# EAGLE design tron_disc (EAGLE 6.5.0)

## Sheet 1 of 3
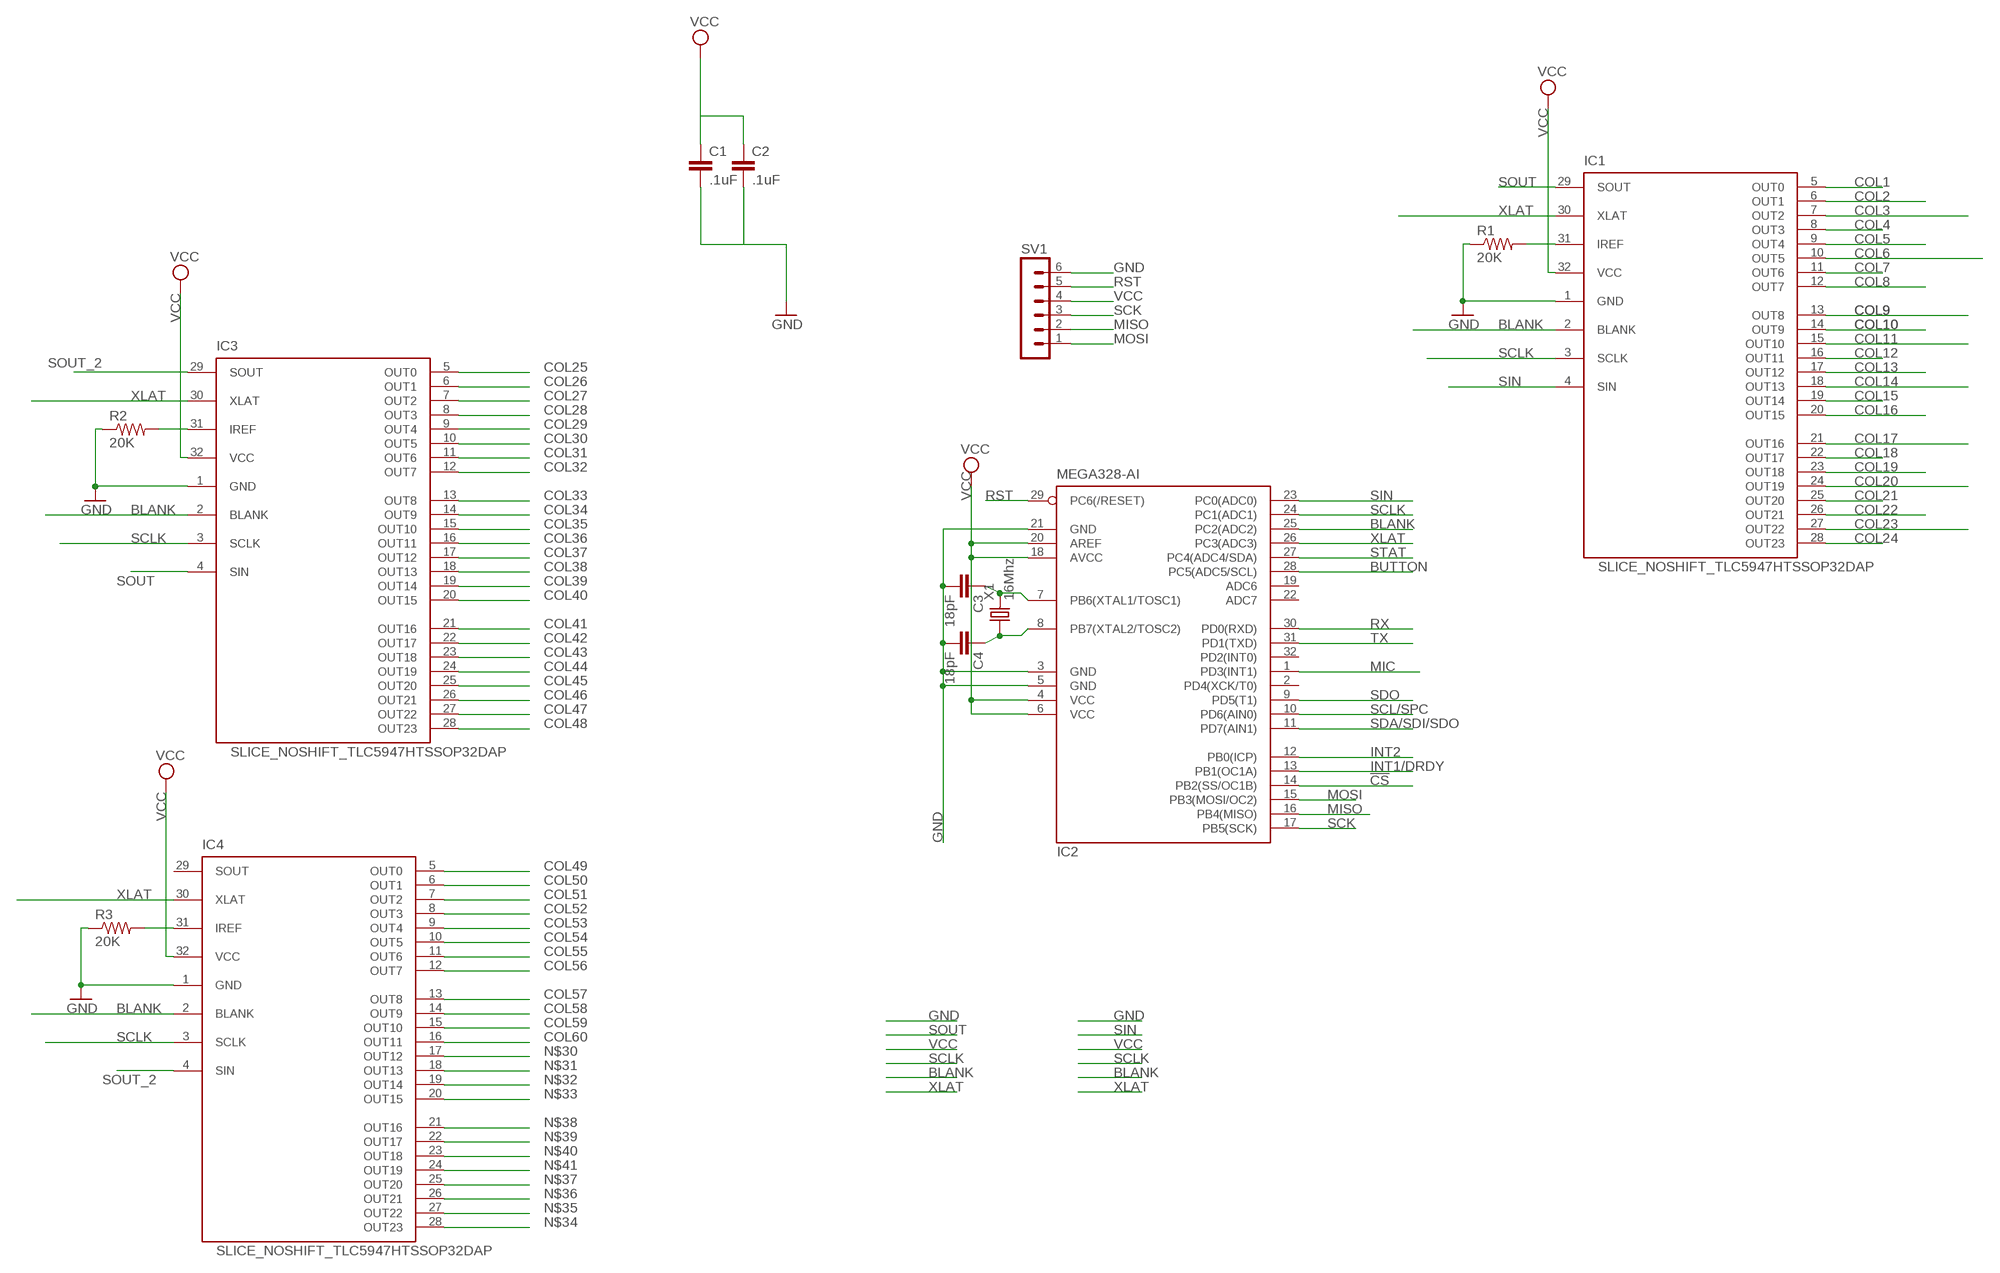
[diagram p0: schematic, sheet 1]

### Parts
C1  .1uF  CAP0805  [0805]
C2  .1uF  CAP0805  [0805]
C3  18pF  CAP0805  [0805]
C4  18pF  CAP0805  [0805]
IC1  SLICE_NOSHIFT_TLC5947HTSSOP32DAP  [HTSSOP32DAP]
IC2  MEGA328-AI  MEGA8-AI  [TQFP32-08]
IC3  SLICE_NOSHIFT_TLC5947HTSSOP32DAP  [HTSSOP32DAP]
IC4  SLICE_NOSHIFT_TLC5947HTSSOP32DAP  [HTSSOP32DAP]
R1  20K  R-US_R0805  [R0805]
R2  20K  R-US_R0805  [R0805]
R3  20K  R-US_R0805  [R0805]
SV1  MA06-1  [MA06-1]
X1  16Mhz  CRYSTAL-5032  [5032]

### Nets
!CS: IC2.14(PB2(SS/OC1B))
BLANK: IC1.2(BLANK) IC2.25(PC2(ADC2)) IC3.2(BLANK) IC4.2(BLANK)
BUTTON: IC2.28(PC5(ADC5/SCL)) ; also sheet 3
COL1: IC1.5(OUT0) ; also sheet 2
COL2: IC1.6(OUT1) ; also sheet 2
COL3: IC1.7(OUT2) ; also sheet 2
COL4: IC1.8(OUT3) ; also sheet 2
COL5: IC1.9(OUT4) ; also sheet 2
COL6: IC1.10(OUT5) ; also sheet 2
COL7: IC1.11(OUT6) ; also sheet 2
COL8: IC1.12(OUT7) ; also sheet 2
COL9: IC1.13(OUT8) ; also sheet 2
COL10: IC1.14(OUT9) ; also sheet 2
COL11: IC1.15(OUT10) ; also sheet 2
COL12: IC1.16(OUT11) ; also sheet 2
COL13: IC1.17(OUT12) ; also sheet 2
COL14: IC1.18(OUT13) ; also sheet 2
COL15: IC1.19(OUT14) ; also sheet 2
COL16: IC1.20(OUT15) ; also sheet 2
COL17: IC1.21(OUT16) ; also sheet 2
COL18: IC1.22(OUT17) ; also sheet 2
COL19: IC1.23(OUT18) ; also sheet 2
COL20: IC1.24(OUT19) ; also sheet 2
COL21: IC1.25(OUT20) ; also sheet 2
COL22: IC1.26(OUT21) ; also sheet 2
COL23: IC1.27(OUT22) ; also sheet 2
COL24: IC1.28(OUT23) ; also sheet 2
COL25: IC3.5(OUT0) ; also sheet 2
COL26: IC3.6(OUT1) ; also sheet 2
COL27: IC3.7(OUT2) ; also sheet 2
COL28: IC3.8(OUT3) ; also sheet 2
COL29: IC3.9(OUT4) ; also sheet 2
COL30: IC3.10(OUT5) ; also sheet 2
COL31: IC3.11(OUT6) ; also sheet 2
COL32: IC3.12(OUT7) ; also sheet 2
COL33: IC3.13(OUT8) ; also sheet 2
COL34: IC3.14(OUT9) ; also sheet 2
COL35: IC3.15(OUT10) ; also sheet 2
COL36: IC3.16(OUT11) ; also sheet 2
COL37: IC3.17(OUT12) ; also sheet 2
COL38: IC3.18(OUT13) ; also sheet 2
COL39: IC3.19(OUT14) ; also sheet 2
COL40: IC3.20(OUT15) ; also sheet 2
COL41: IC3.21(OUT16) ; also sheet 2
COL42: IC3.22(OUT17) ; also sheet 2
COL43: IC3.23(OUT18) ; also sheet 2
COL44: IC3.24(OUT19) ; also sheet 2
COL45: IC3.25(OUT20) ; also sheet 2
COL46: IC3.26(OUT21) ; also sheet 2
COL47: IC3.27(OUT22) ; also sheet 2
COL48: IC3.28(OUT23) ; also sheet 2
COL49: IC4.5(OUT0) ; also sheet 2
COL50: IC4.6(OUT1) ; also sheet 2
COL51: IC4.7(OUT2) ; also sheet 2
COL52: IC4.8(OUT3) ; also sheet 2
COL53: IC4.9(OUT4) ; also sheet 2
COL54: IC4.10(OUT5) ; also sheet 2
COL55: IC4.11(OUT6) ; also sheet 2
COL56: IC4.12(OUT7) ; also sheet 2
COL57: IC4.13(OUT8) ; also sheet 2
COL58: IC4.14(OUT9) ; also sheet 2
COL59: IC4.15(OUT10) ; also sheet 2
COL60: IC4.16(OUT11) ; also sheet 2
GND: C1.2 C2.2 C3.2 C4.2 IC1.1(GND) IC2.3(GND) IC2.5(GND) IC2.21(GND) IC3.1(GND) IC4.1(GND) R1.1 R2.1 R3.1 SV1.6 ; also sheet 3
INT1/DRDY: IC2.13(PB1(OC1A))
INT2: IC2.12(PB0(ICP))
MIC: IC2.1(PD3(INT1))
MISO: IC2.16(PB4(MISO)) SV1.2
MOSI: IC2.15(PB3(MOSI/OC2)) SV1.1
N$1: IC3.31(IREF) R2.2
N$7: C3.1 IC2.7(PB6(XTAL1/TOSC1)) X1.2
N$8: C4.1 IC2.8(PB7(XTAL2/TOSC2)) X1.1
N$13: IC1.31(IREF) R1.2
N$30: IC4.17(OUT12)
N$31: IC4.18(OUT13)
N$32: IC4.19(OUT14)
N$33: IC4.20(OUT15)
N$34: IC4.28(OUT23)
N$35: IC4.27(OUT22)
N$36: IC4.26(OUT21)
N$37: IC4.25(OUT20)
N$38: IC4.21(OUT16)
N$39: IC4.22(OUT17)
N$40: IC4.23(OUT18)
N$41: IC4.24(OUT19)
N$64: IC4.31(IREF) R3.2
RST: IC2.29(PC6(/RESET)) SV1.5 ; also sheet 3
RX: IC2.30(PD0(RXD))
SCK: IC2.17(PB5(SCK)) SV1.3
SCL/SPC: IC2.10(PD6(AIN0))
SCLK: IC1.3(SCLK) IC2.24(PC1(ADC1)) IC3.3(SCLK) IC4.3(SCLK)
SDA/SDI/SDO: IC2.11(PD7(AIN1))
SDO: IC2.9(PD5(T1))
SIN: IC1.4(SIN) IC2.23(PC0(ADC0))
SOUT: IC1.29(SOUT) IC3.4(SIN)
SOUT_2: IC3.29(SOUT) IC4.4(SIN)
STAT: IC2.27(PC4(ADC4/SDA))
TX: IC2.31(PD1(TXD))
VCC: C1.1 C2.1 IC1.32(VCC) IC2.4(VCC) IC2.6(VCC) IC2.18(AVCC) IC2.20(AREF) IC3.32(VCC) IC4.32(VCC) SV1.4 ; also sheet 2
XLAT: IC1.30(XLAT) IC2.26(PC3(ADC3)) IC3.30(XLAT) IC4.30(XLAT)
Unconnected: IC2.2(PD4(XCK/T0)) IC2.19(ADC6) IC2.22(ADC7) IC2.32(PD2(INT0)) IC4.29(SOUT)

## Sheet 2 of 3
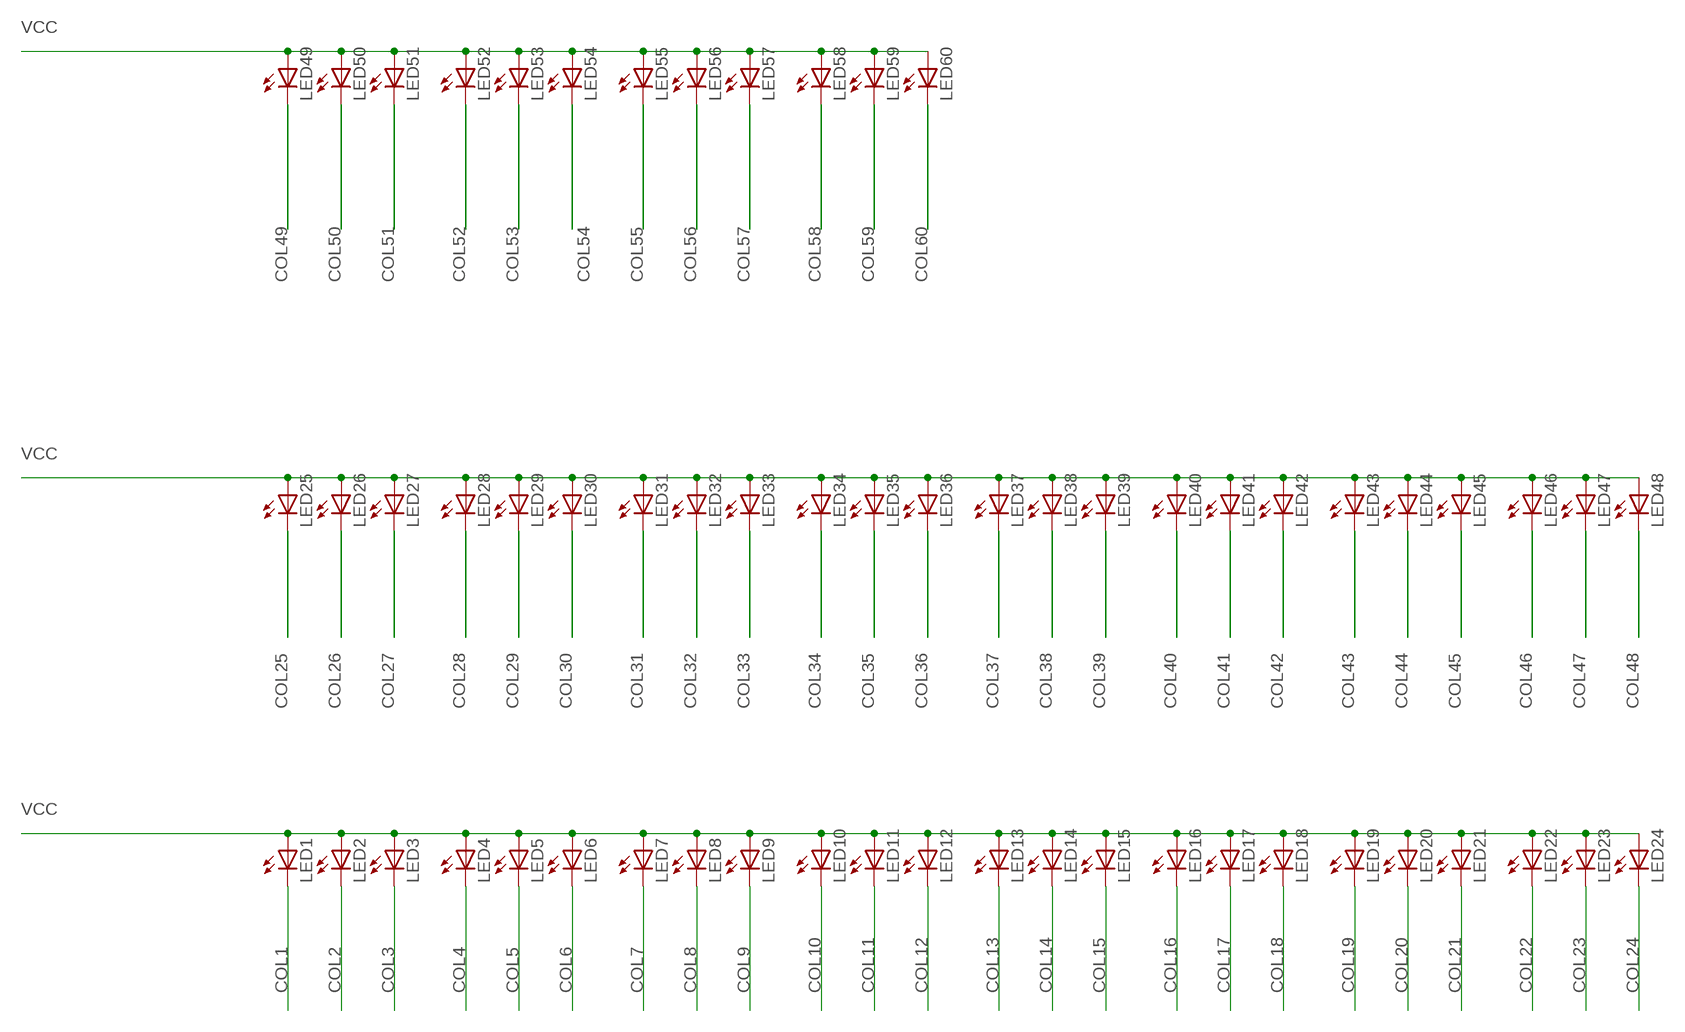
[diagram p1: schematic, sheet 2]

### Parts
LED1  LEDCHIPLED_1206  [CHIPLED_1206]
LED2  LEDCHIPLED_1206  [CHIPLED_1206]
LED3  LEDCHIPLED_1206  [CHIPLED_1206]
LED4  LEDCHIPLED_1206  [CHIPLED_1206]
LED5  LEDCHIPLED_1206  [CHIPLED_1206]
LED6  LEDCHIPLED_1206  [CHIPLED_1206]
LED7  LEDCHIPLED_1206  [CHIPLED_1206]
LED8  LEDCHIPLED_1206  [CHIPLED_1206]
LED9  LEDCHIPLED_1206  [CHIPLED_1206]
LED10  LEDCHIPLED_1206  [CHIPLED_1206]
LED11  LEDCHIPLED_1206  [CHIPLED_1206]
LED12  LEDCHIPLED_1206  [CHIPLED_1206]
LED13  LEDCHIPLED_1206  [CHIPLED_1206]
LED14  LEDCHIPLED_1206  [CHIPLED_1206]
LED15  LEDCHIPLED_1206  [CHIPLED_1206]
LED16  LEDCHIPLED_1206  [CHIPLED_1206]
LED17  LEDCHIPLED_1206  [CHIPLED_1206]
LED18  LEDCHIPLED_1206  [CHIPLED_1206]
LED19  LEDCHIPLED_1206  [CHIPLED_1206]
LED20  LEDCHIPLED_1206  [CHIPLED_1206]
LED21  LEDCHIPLED_1206  [CHIPLED_1206]
LED22  LEDCHIPLED_1206  [CHIPLED_1206]
LED23  LEDCHIPLED_1206  [CHIPLED_1206]
LED24  LEDCHIPLED_1206  [CHIPLED_1206]
LED25  LEDCHIPLED_1206  [CHIPLED_1206]
LED26  LEDCHIPLED_1206  [CHIPLED_1206]
LED27  LEDCHIPLED_1206  [CHIPLED_1206]
LED28  LEDCHIPLED_1206  [CHIPLED_1206]
LED29  LEDCHIPLED_1206  [CHIPLED_1206]
LED30  LEDCHIPLED_1206  [CHIPLED_1206]
LED31  LEDCHIPLED_1206  [CHIPLED_1206]
LED32  LEDCHIPLED_1206  [CHIPLED_1206]
LED33  LEDCHIPLED_1206  [CHIPLED_1206]
LED34  LEDCHIPLED_1206  [CHIPLED_1206]
LED35  LEDCHIPLED_1206  [CHIPLED_1206]
LED36  LEDCHIPLED_1206  [CHIPLED_1206]
LED37  LEDCHIPLED_1206  [CHIPLED_1206]
LED38  LEDCHIPLED_1206  [CHIPLED_1206]
LED39  LEDCHIPLED_1206  [CHIPLED_1206]
LED40  LEDCHIPLED_1206  [CHIPLED_1206]
LED41  LEDCHIPLED_1206  [CHIPLED_1206]
LED42  LEDCHIPLED_1206  [CHIPLED_1206]
LED43  LEDCHIPLED_1206  [CHIPLED_1206]
LED44  LEDCHIPLED_1206  [CHIPLED_1206]
LED45  LEDCHIPLED_1206  [CHIPLED_1206]
LED46  LEDCHIPLED_1206  [CHIPLED_1206]
LED47  LEDCHIPLED_1206  [CHIPLED_1206]
LED48  LEDCHIPLED_1206  [CHIPLED_1206]
LED49  LEDCHIPLED_1206  [CHIPLED_1206]
LED50  LEDCHIPLED_1206  [CHIPLED_1206]
LED51  LEDCHIPLED_1206  [CHIPLED_1206]
LED52  LEDCHIPLED_1206  [CHIPLED_1206]
LED53  LEDCHIPLED_1206  [CHIPLED_1206]
LED54  LEDCHIPLED_1206  [CHIPLED_1206]
LED55  LEDCHIPLED_1206  [CHIPLED_1206]
LED56  LEDCHIPLED_1206  [CHIPLED_1206]
LED57  LEDCHIPLED_1206  [CHIPLED_1206]
LED58  LEDCHIPLED_1206  [CHIPLED_1206]
LED59  LEDCHIPLED_1206  [CHIPLED_1206]
LED60  LEDCHIPLED_1206  [CHIPLED_1206]

### Nets
COL1: LED1.C ; also sheet 1
COL2: LED2.C ; also sheet 1
COL3: LED3.C ; also sheet 1
COL4: LED4.C ; also sheet 1
COL5: LED5.C ; also sheet 1
COL6: LED6.C ; also sheet 1
COL7: LED7.C ; also sheet 1
COL8: LED8.C ; also sheet 1
COL9: LED9.C ; also sheet 1
COL10: LED10.C ; also sheet 1
COL11: LED11.C ; also sheet 1
COL12: LED12.C ; also sheet 1
COL13: LED13.C ; also sheet 1
COL14: LED14.C ; also sheet 1
COL15: LED15.C ; also sheet 1
COL16: LED16.C ; also sheet 1
COL17: LED17.C ; also sheet 1
COL18: LED18.C ; also sheet 1
COL19: LED19.C ; also sheet 1
COL20: LED20.C ; also sheet 1
COL21: LED21.C ; also sheet 1
COL22: LED22.C ; also sheet 1
COL23: LED23.C ; also sheet 1
COL24: LED24.C ; also sheet 1
COL25: LED25.C ; also sheet 1
COL26: LED26.C ; also sheet 1
COL27: LED27.C ; also sheet 1
COL28: LED28.C ; also sheet 1
COL29: LED29.C ; also sheet 1
COL30: LED30.C ; also sheet 1
COL31: LED31.C ; also sheet 1
COL32: LED32.C ; also sheet 1
COL33: LED33.C ; also sheet 1
COL34: LED34.C ; also sheet 1
COL35: LED35.C ; also sheet 1
COL36: LED36.C ; also sheet 1
COL37: LED37.C ; also sheet 1
COL38: LED38.C ; also sheet 1
COL39: LED39.C ; also sheet 1
COL40: LED40.C ; also sheet 1
COL41: LED41.C ; also sheet 1
COL42: LED42.C ; also sheet 1
COL43: LED43.C ; also sheet 1
COL44: LED44.C ; also sheet 1
COL45: LED45.C ; also sheet 1
COL46: LED46.C ; also sheet 1
COL47: LED47.C ; also sheet 1
COL48: LED48.C ; also sheet 1
COL49: LED49.C ; also sheet 1
COL50: LED50.C ; also sheet 1
COL51: LED51.C ; also sheet 1
COL52: LED52.C ; also sheet 1
COL53: LED53.C ; also sheet 1
COL54: LED54.C ; also sheet 1
COL55: LED55.C ; also sheet 1
COL56: LED56.C ; also sheet 1
COL57: LED57.C ; also sheet 1
COL58: LED58.C ; also sheet 1
COL59: LED59.C ; also sheet 1
COL60: LED60.C ; also sheet 1
VCC: LED1.A LED2.A LED3.A LED4.A LED5.A LED6.A LED7.A LED8.A LED9.A LED10.A LED11.A LED12.A LED13.A LED14.A LED15.A LED16.A LED17.A LED18.A LED19.A LED20.A LED21.A LED22.A LED23.A LED24.A LED25.A LED26.A LED27.A LED28.A LED29.A LED30.A LED31.A LED32.A LED33.A LED34.A LED35.A LED36.A LED37.A LED38.A LED39.A LED40.A LED41.A LED42.A LED43.A LED44.A LED45.A LED46.A LED47.A LED48.A LED49.A LED50.A LED51.A LED52.A LED53.A LED54.A LED55.A LED56.A LED57.A LED58.A LED59.A LED60.A ; also sheet 1

## Sheet 3 of 3
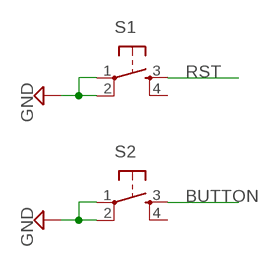
[diagram p2: schematic, sheet 3]

### Parts
S1  TAC_SWITCHSMD  [TACTILE_SWITCH_SMD]
S2  TAC_SWITCHSMD  [TACTILE_SWITCH_SMD]

### Nets
BUTTON: S2.3 ; also sheet 1
GND: S1.1 S1.2 S2.1 S2.2 ; also sheet 1
RST: S1.3 ; also sheet 1
Unconnected: S1.4 S2.4

## Library data of the parts
C1-C4 = slice_noshift:CAP: Capacitor Standard 0603 ceramic capacitor, and 0.1" leaded capacitor.
IC1 IC3 IC4 = 23b_clock_noleds:SLICE_NOSHIFT_TLC5947
IC2 = atmel:MEGA8: MICROCONTROLLER 8 Kbytes FLASH, 1 kbytes SRAM, 512 bytes EEPROM, USART, 6-channel 10 bit ADC, 2-channel 8 bit ADC Pin compatible with Atmega48, ATMega88, ATMega168 Source: avr.lbr; MPN: ATMEGA8-16AU; OC_FARNELL: 9171371; OC_NEWARK: 73M8863
LED1-LED60 = led:LED: LED OSRAM: - CHIPLED LG R971, LG N971, LY N971, LG Q971, LY Q971, LO R971, LY R971 LH N974, LH R974 LS Q976, LO Q976, LY Q976 LO Q996 - Hyper CHIPLED LW Q18S LB Q993, LB Q99A, LB R99A - SideLED LS A670, LO A670, LY A670, LG A670, LP A670 LB A673, LV A673, LT A673, LW A673 LH A674 LY A675 LS A676, LA A676, LO A676, LY A676, LW A676 LS A679, LY A679, LG A679 - Hyper Micro SIDELED® LS Y876, LA Y876, LO Y876, LY Y876 LT Y87S - SmartLED LW L88C, LW L88S LB L89C, LB L89S, LG L890 LS L89K, LO L89K, LY L89K LS L896, LA L896, LO L896, LY L896 - TOPLED LS T670, LO T670, LY T670, LG T670, LP T670 LSG T670, LSP T670, LSY T670, LOP T670, LYG T670 LG T671, LOG T671, LSG T671 LB T673, LV T673, LT T673, LW T673 LH T674 LS T676, LA T676, LO T676, LY T676, LB T676, LH T676, LSB T676, LW T676 LB T67C, LV T67C, LT T67C, LS T67K, LO T67K, LY T67K, LW E67C LS E67B, LA E67B, LO E67B, LY E67B, LB E67C, LV E67C, LT E67C LW T67C LS T679, LY T679, LG T679 LS T770, LO T770, LY T770, LG T770, LP T770 LB T773, LV T773, LT T773, LW T773 LH T774 LS E675, LA E675, LY E675, LS T675 LS T776, LA T776, LO T776, LY T776, LB T776 LHGB T686 LT T68C, LB T68C - Hyper Mini TOPLED® LB M676 - Mini TOPLED Santana® LG M470 LS M47K, LO M47K, LY M47K Source: http://www.osram.convergy.de LUXEON: - LUMILED® LXK2-PW12-R00, LXK2-PW12-S00, LXK2-PW14-U00, LXK2-PW14-V00 LXK2-PM12-R00, LXK2-PM12-S00, LXK2-PM14-U00 LXK2-PE12-Q00, LXK2-PE12-R00, LXK2-PE12-S00, LXK2-PE14-T00, LXK2-PE14-U00 LXK2-PB12-K00, LXK2-PB12-L00, LXK2-PB12-M00, LXK2-PB14-N00, LXK2-PB14-P00, LXK2-PB14-Q00 LXK2-PR12-L00, LXK2-PR12-M00, LXK2-PR14-Q00, LXK2-PR14-R00 LXK2-PD12-Q00, LXK2-PD12-R00, LXK2-PD12-S00 LXK2-PH12-R00, LXK2-PH12-S00 LXK2-PL12-P00, LXK2-PL12-Q00, LXK2-PL12-R00 Source: www.luxeon.com KINGBRIGHT: KA-3528ASYC Source: www.kingbright.com
R1-R3 = rcl:R-US_: RESISTOR, American symbol
S1 S2 = SparkFun:TAC_SWITCH: Momentary Switch Button commonly used for reset or general input. Spark Fun Electronics SKU : COM-00097
SV1 = NSL:MA06-1: PIN HEADER
X1 = NSL_MiniQuad:CRYSTAL*: CRYSTAL

## Net classes
0 default: width 0.254 mm

## Board
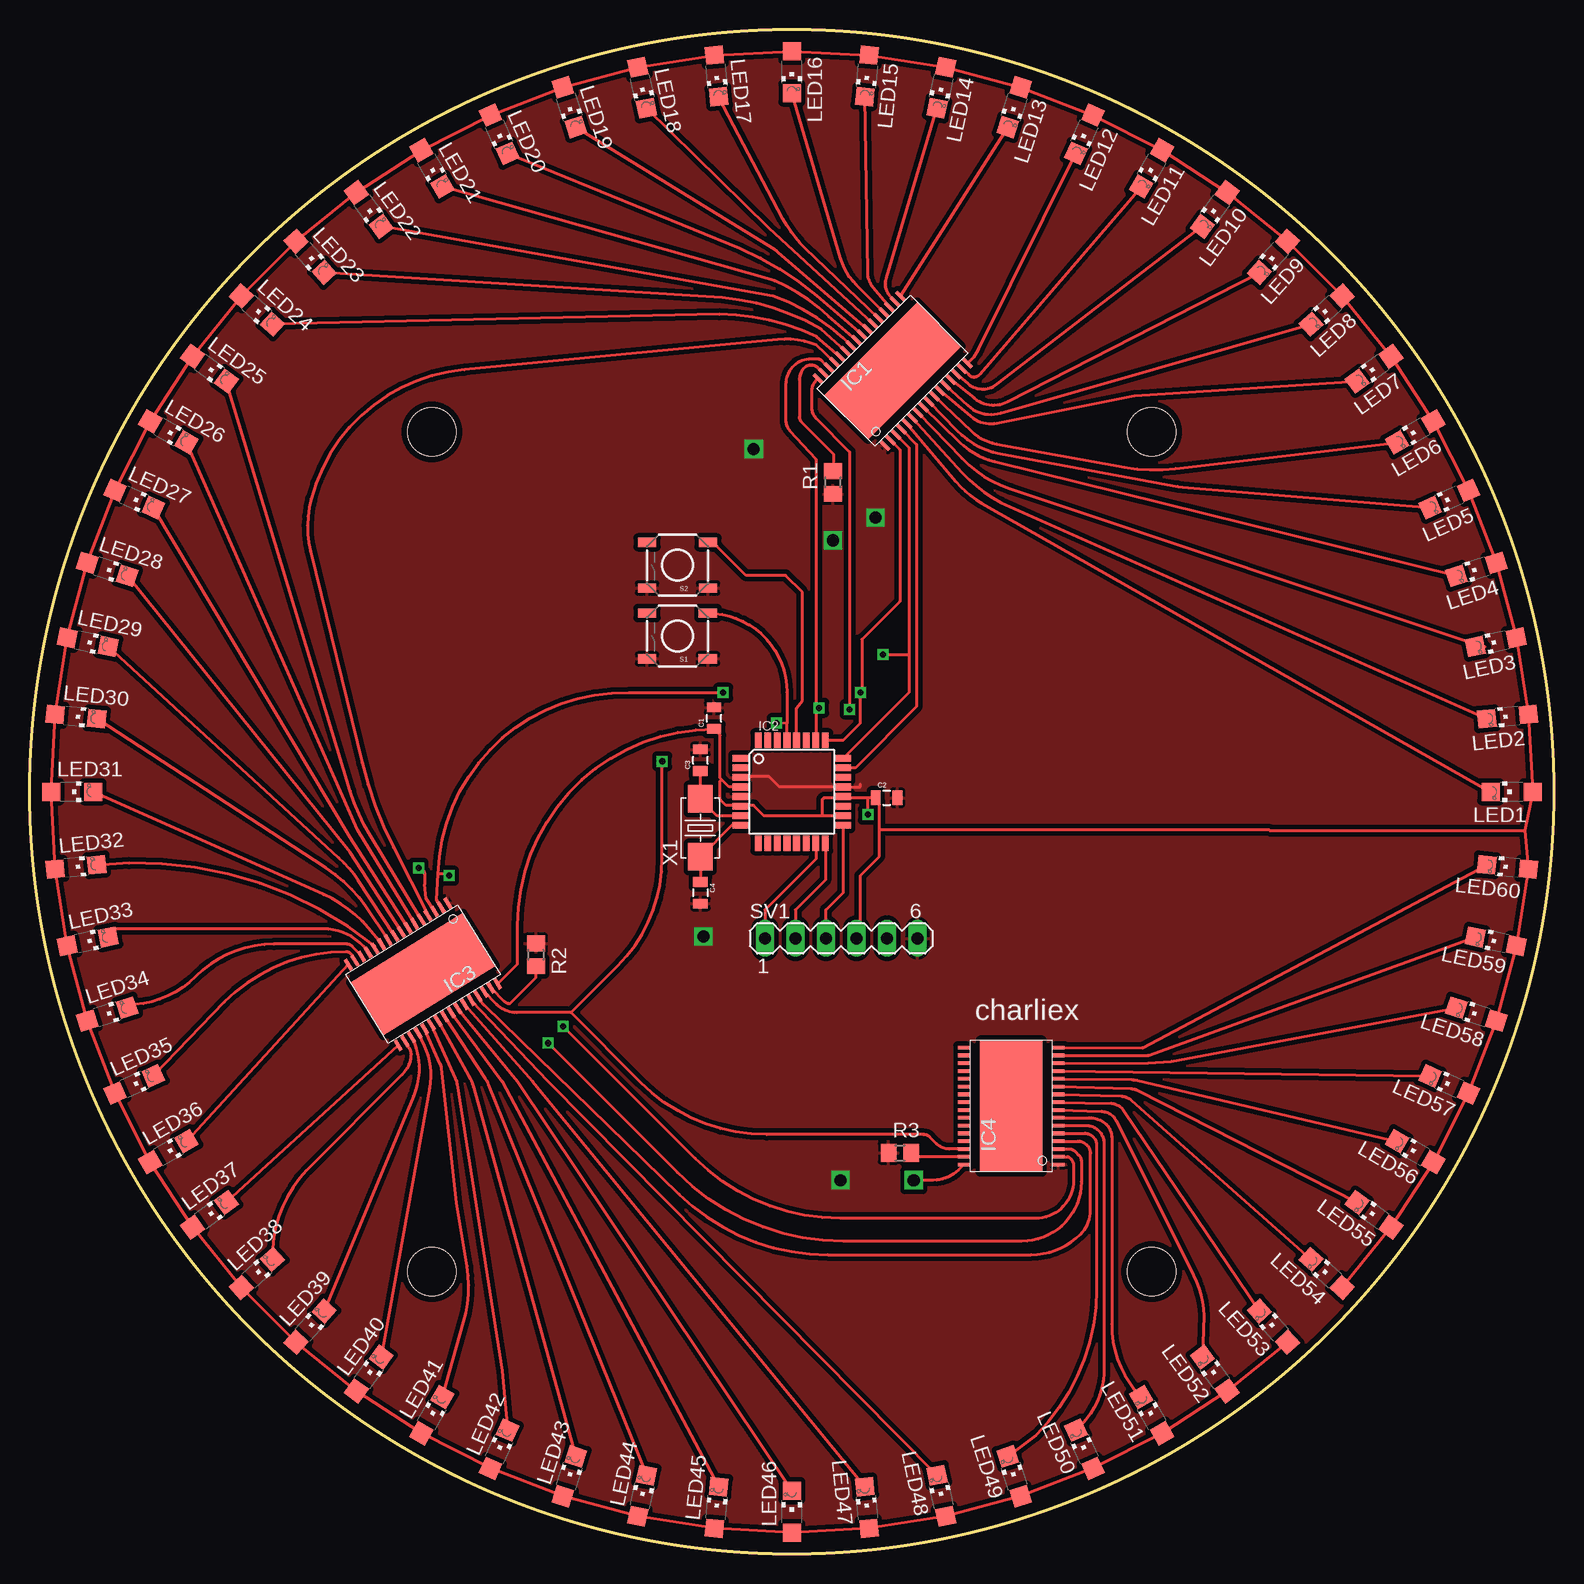
[diagram p3: board, top side]
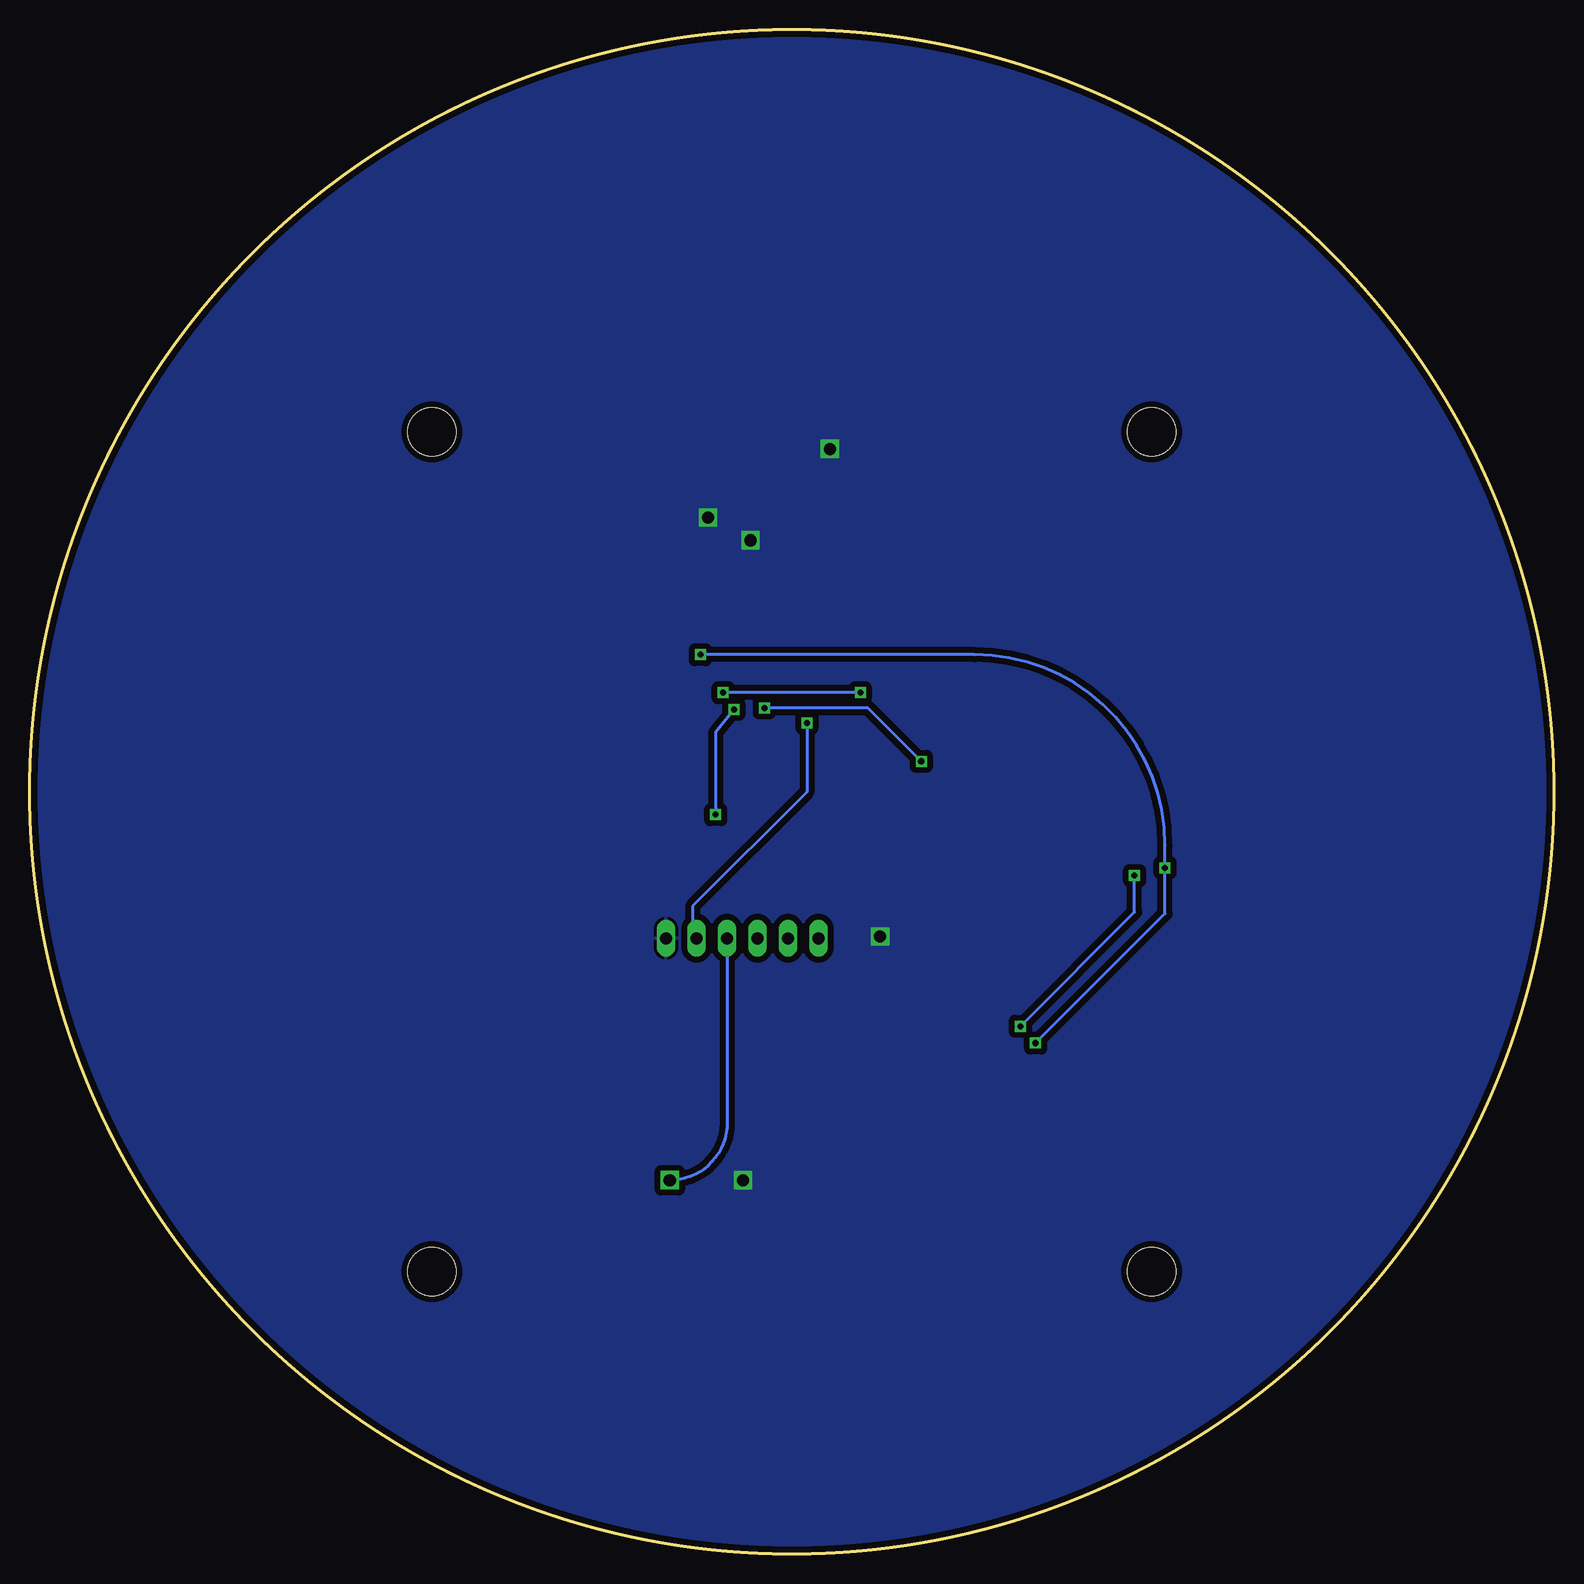
[diagram p4: board, bottom side, seen from below]

Size 127 x 127 mm. Coordinates in mm from the lower left corner, seen from the top.
Outline: circle at 63.5,63.5 radius 63.5
Copper layers (1*16): Top 0.0178mm / dielectric 59mil / Bottom 0.0178mm
Design rules "SSC-EAGLE-2Lyr_v1.0.0.3": minimum track width 6mil, minimum drill 14mil, track to track 6mil, track to pad 6mil, pad to pad 6mil, via to via 6mil, smd to smd 6mil, copper to edge 20mil, drill to drill 16mil, minimum pad ring 8mil, minimum via ring 8mil, stop-mask expansion 3mil, vias tented up to drill 0mil, thermal gap 10mil
Holes 4 mm at 33.5,93.5 33.5,23.5 93.5,23.5 93.5,93.5
Milling: area 0,0 to 127,127

### Footprints (pad centres in the part's own frame; a part is rotated, then mirrored left to right if it is on the bottom)
0805 = smd 0.8 x 1.2: 1 -0.9,0; 2 0.9,0
HTSSOP32DAP = smd 0.3 x 1: 1 -4.875,-3.95; 2 -4.225,-3.95; 3 -3.575,-3.95; 4 -2.925,-3.95; 5 -2.275,-3.95; 6 -1.625,-3.95; 7 -0.975,-3.95; 8 -0.325,-3.95; 9 0.325,-3.95; 10 0.975,-3.95; 11 1.625,-3.95; 12 2.275,-3.95; 13 2.925,-3.95; 14 3.575,-3.95; 15 4.225,-3.95; 16 4.875,-3.95; 17 4.875,3.95; 18 4.225,3.95; 19 3.575,3.95; 20 2.925,3.95; 21 2.275,3.95; 22 1.625,3.95; 23 0.975,3.95; 24 0.325,3.95; 25 -0.325,3.95; 26 -0.975,3.95; 27 -1.625,3.95; 28 -2.275,3.95; 29 -2.925,3.95; 30 -3.575,3.95; 31 -4.225,3.95; 32 -4.875,3.95 | smd 11 x 5.2: EXP 0,0
TQFP32-08 = smd 1.27 x 0.559: 1 -4.293,2.8; 2 -4.293,2; 3 -4.293,1.2; 4 -4.293,0.4; 5 -4.293,-0.4; 6 -4.293,-1.2; 7 -4.293,-2; 8 -4.293,-2.8; 17 4.293,-2.8; 18 4.293,-2; 19 4.293,-1.2; 20 4.293,-0.4; 21 4.293,0.4; 22 4.293,1.2; 23 4.293,2; 24 4.293,2.8 | smd 0.559 x 1.27: 9 -2.8,-4.293; 10 -2,-4.293; 11 -1.2,-4.293; 12 -0.4,-4.293; 13 0.4,-4.293; 14 1.2,-4.293; 15 2,-4.293; 16 2.8,-4.293; 25 2.8,4.293; 26 2,4.293; 27 1.2,4.293; 28 0.4,4.293; 29 -0.4,4.293; 30 -1.2,4.293; 31 -2,4.293; 32 -2.8,4.293
CHIPLED_1206 = smd 1.5 x 1.5: A 0,-1.75; C 0,1.75
R0805 = smd 1.3 x 1.5: 1 -0.95,0; 2 0.95,0
TACTILE_SWITCH_SMD = smd 1.524 x 0.762: 1 -2.54,1.905; 2 2.54,1.905; 3 -2.54,-1.905; 4 2.54,-1.905
MA06-1 = drill 1.016 long: 1 -6.35,0; 2 -3.81,0; 3 -1.27,0; 4 1.27,0; 5 3.81,0; 6 6.35,0
5032 = smd 2.286 x 2.032: 1 -2.413,0; 2 2.413,0

### Placement (x,y rotation side)
C1  57.02,69.63 90 top
C2  71.41,63 0 top
C3  55.88,66.13 90 top
C4  55.88,55.08 270 top
IC1  71.91,98.59 45 top
IC2  63.5,63.5 0 top
IC3  32.76,48.29 211.7 top
IC4  81.79,37.3 90 top
LED1  123.5,63.5 90 top
LED2  123.17,69.77 96 top
LED3  122.19,75.97 102 top
LED4  120.56,82.04 108 top
LED5  118.31,87.9 114 top
LED6  115.46,93.5 120 top
LED7  112.04,98.77 126 top
LED8  108.09,103.65 132 top
LED9  103.65,108.09 138 top
LED10  98.77,112.04 144 top
LED11  93.5,115.46 150 top
LED12  87.9,118.31 156 top
LED13  82.04,120.56 162 top
LED14  75.97,122.19 168 top
LED15  69.77,123.17 174 top
LED16  63.5,123.5 180 top
LED17  57.23,123.17 186 top
LED18  51.03,122.19 192 top
LED19  44.96,120.56 198 top
LED20  39.1,118.31 204 top
LED21  33.5,115.46 210 top
LED22  28.23,112.04 216 top
LED23  23.35,108.09 222 top
LED24  18.91,103.65 228 top
LED25  14.96,98.77 234 top
LED26  11.54,93.5 240 top
LED27  8.69,87.9 246 top
LED28  6.44,82.04 252 top
LED29  4.81,75.97 258 top
LED30  3.83,69.77 264 top
LED31  3.5,63.5 270 top
LED32  3.83,57.23 276 top
LED33  4.81,51.03 282 top
LED34  6.44,44.96 288 top
LED35  8.69,39.1 294 top
LED36  11.54,33.5 300 top
LED37  14.96,28.23 306 top
LED38  18.91,23.35 312 top
LED39  23.35,18.91 318 top
LED40  28.23,14.96 324 top
LED41  33.5,11.54 330 top
LED42  39.1,8.69 336 top
LED43  44.96,6.44 342 top
LED44  51.03,4.81 348 top
LED45  57.23,3.83 354 top
LED46  63.5,3.5 0 top
LED47  69.77,3.83 6 top
LED48  75.97,4.81 12 top
LED49  82.04,6.44 18 top
LED50  87.9,8.69 24 top
LED51  93.5,11.54 30 top
LED52  98.77,14.96 36 top
LED53  103.65,18.91 42 top
LED54  108.09,23.35 48 top
LED55  112.04,28.23 54 top
LED56  115.46,33.5 60 top
LED57  118.31,39.1 66 top
LED58  120.56,44.96 72 top
LED59  122.19,51.03 78 top
LED60  123.17,57.23 84 top
R1  66.93,89.28 90 top
R2  42.17,49.91 270 top
R3  72.52,33.4 0 top
S1  53.97,76.49 180 top
S2  53.98,82.39 180 top
SV1  67.62,51.28 0 top
X1  55.88,60.49 90 top

### Tracks (layer width: path | path; a pad name or v marks a point on that pad's centre or on a via)
BLANK  (via drill 0.51)
  Top 0.254: 34.04,56.64 arc-90 49.91,71.75 v57.78,71.75 | IC4.2 86.47,33.08 arc-45 86.62,33.02 86.8,32.84 arc-45 87,32.36 87,31.12 arc-90 83.82,27.94 67.53,27.94 arc-45 55.45,32.94 v44.45,43.94 | v34.92,56.52 34.8,56.64 34.04,56.64 | IC3.2 33.91,54.49 34.04,56.64 | IC1.2 72.52,92.01 72.52,79.38 69.34,76.2 69.34,72.14 v69.22,71.75 69.22,69.22 67.79,67.79 IC2.25
  Bottom 0.254: v57.78,71.75 v69.22,71.75 | v44.45,43.94 34.92,53.47 v34.92,56.52
BUTTON
  Top 0.254: IC2.28 63.9,70.48 64.39,71.12 64.39,80.14 62.99,81.53 59.69,81.53 57.24,83.98 S2.3
COL1
  Top 0.254: IC1.5 77.2,89.34 arc20 79.33,87.58 LED1.C
COL2
  Top 0.254: IC1.6 77.68,90.12 arc24 81.68,87.26 LED2.C
COL3
  Top 0.254: IC1.7 77.68,91.3 arc28 81.69,88.76 121.28,75.56 LED3.C
COL4
  Top 0.254: IC1.8 77.5,92.64 arc31 80.42,91.03 LED4.C
COL5
  Top 0.254: IC1.9 77.24,93.64 arc36 80.87,91.68 95.24,89.02 arc6 96.54,88.85 LED5.C
COL6
  Top 0.254: IC1.10 78.5,93.55 arc33 80.57,92.49 91.22,90.56 arc18 95.49,90.44 LED6.C
COL7
  Top 0.254: IC1.11 78.41,94.79 arc51 80.61,94.23 92.08,96.52 LED7.C
COL8
  Top 0.254: IC1.12 78.19,95.69 arc59 80.91,95.07 LED8.C
COL9
  Top 0.254: IC1.13 78.71,96.3 arc67 81.49,96.02 LED9.C
COL10
  Top 0.254: IC1.14 78.2,97.52 arc78 80.59,97.47 LED10.C
COL11
  Top 0.254: IC1.15 78.25,98.25 arc93 79.17,98.3 LED11.C
COL12
  Top 0.254: IC1.16 arc26 79.07,100.36 LED12.C
COL13
  Top 0.254: IC1.17 LED13.C
COL14
  Top 0.254: IC1.18 71.75,104.74 arc-60 71.38,106.29 LED14.C
COL15
  Top 0.254: IC1.19 70.29,105.53 arc-39 69.84,106.72 LED15.C
COL16
  Top 0.254: IC1.20 68.89,105.74 arc-29 67.58,107.96 LED16.C
COL17
  Top 0.254: IC1.21 64.63,108.78 arc-20 62.79,111.25 LED17.C
COL18
  Top 0.254: IC1.22 61.59,110.49 LED18.C
COL19
  Top 0.254: IC1.23 62.35,108.48 arc8 62.09,108.67 LED19.C
COL20
  Top 0.254: LED20.C 59.2,108.79 arc-17 65.55,104.86 IC1.24
COL21
  Top 0.254: IC1.25 66.57,103.14 arc20 62.05,106.1 LED21.C
COL22
  Top 0.254: IC1.26 67.81,101.31 arc23 61.94,104.83 LED22.C
COL23
  Top 0.254: IC1.27 65.95,102.08 arc24 57.7,104.69 LED23.C
COL24
  Top 0.254: IC1.28 65.58,101.45 arc24 57.47,103.31 LED24.C
COL25
  Top 0.254: IC3.5 28.38,59.82 arc-14 26.69,63.58 LED25.C
COL26
  Top 0.254: IC3.6 27.3,60.33 LED26.C
COL27
  Top 0.254: IC3.7 26.67,59.69 LED27.C
COL28
  Top 0.254: IC3.8 26.67,58.42 LED28.C
COL29
  Top 0.254: IC3.9 27.37,56.09 arc15 25.73,58 LED29.C
COL30
  Top 0.254: IC3.10 27.99,53.92 arc24 24.68,57.15 LED30.C
COL31
  Top 0.254: IC3.11 28.2,52.13 arc27 24.47,54.93 LED31.C
COL32
  Top 0.254: IC3.12 28.75,50.62 arc45 5.5,57.36 LED32.C
COL33
  Top 0.254: IC3.13 28.02,50.34 arc52 24.48,52.07 6.83,52.07 arc90 LED33.C
COL34
  Top 0.254: IC3.14 27.64,49.83 26.86,50.61 arc45 26.41,50.8 20.33,50.8 arc45 13.81,48.1 arc-45 8.06,45.72 8.01,45.72 LED34.C
COL35
  Top 0.254: IC3.15 26.83,49.88 arc60 26.34,50.16 arc45 16.2,45.97 LED35.C
COL36
  Top 0.254: IC3.16 LED36.C
COL37
  Top 0.254: IC3.17 LED37.C
COL38
  Top 0.254: LED38.C arc-45 23.07,31.96 31.04,39.93 arc45 31.75,41.65 arc33 31.61,42.13 IC3.18
COL39
  Top 0.254: IC3.19 arc-50 31.96,38.15 LED39.C
COL40
  Top 0.254: IC3.20 32.85,42.33 arc-36 33.31,38.81 LED40.C
COL41
  Top 0.254: LED41.C 36.14,19.31 arc26 36.44,23.94 35.56,29.21 34.31,40.44 arc18 34.21,40.82 IC3.21
COL42
  Top 0.254: IC3.22 35.45,39.61 arc-15 35.6,39.11 39.37,15.24 LED42.C
COL43
  Top 0.254: IC3.23 36.57,39.83 arc-14 36.97,38.86 LED43.C
COL44
  Top 0.254: IC3.24 37.95,39.59 arc-12 38.2,39.12 LED44.C
COL45
  Top 0.254: IC3.25 39.37,39.37 LED45.C
COL46
  Top 0.254: IC3.26 40.64,39.37 LED46.C
COL47
  Top 0.254: IC3.27 41.91,39.37 LED47.C
COL48
  Top 0.254: IC3.28 43.18,39.37 LED48.C
COL49
  Top 0.254: IC4.5 87.93,35.02 arc-90 88.9,34.05 88.9,22.03 arc-45 83.85,9.85 LED49.C
COL50
  Top 0.254: IC4.6 88.06,35.67 arc-45 89.08,35.25 arc-45 89.53,34.15 89.53,15.03 arc-45 LED50.C
COL51
  Top 0.254: LED51.C arc-45 90.17,19.15 90.17,34.72 arc45 89.76,35.72 arc45 88.3,36.33 IC4.7
COL52
  Top 0.254: IC4.8 89.33,36.86 arc-62 90.55,36.07 97,23.18 arc-24 97.86,19.82 LED52.C
COL53
  Top 0.254: IC4.9 90.14,37.53 arc-51 91.18,36.91 LED53.C
COL54
  Top 0.254: IC4.10 90.96,38.14 arc-37 91.8,37.78 LED54.C
COL55
  Top 0.254: IC4.11 91.78,38.75 arc-24 92.34,38.6 LED55.C
COL56
  Top 0.254: IC4.12 91.85,39.51 arc-11 92.29,39.44 LED56.C
COL57
  Top 0.254: IC4.13 LED57.C
COL58
  Top 0.254: IC4.14 93.19,40.89 arc4 95.15,41.02 LED58.C
COL59
  Top 0.254: IC4.15 93.22,41.53 LED59.C
COL60
  Top 0.254: IC4.16 92.71,42.16 LED60.C
GND  (via drill 1.02)
  Top 0.254: 69.22,64.14 69.22,63.9 IC2.21 62.47,63.9 61.59,64.77 59.28,64.77 IC2.3
  other vias: 60.33,92.08 70.48,86.36 66.93,84.45 56.13,51.44 67.56,31.12
  pour Top (isolate 0.381): -0.64,62.3 arc90 62.3,-0.32 65.07,-0.31 arc90 127.64,62.57 127.64,67.24 arc90 65.97,128.91 arc90
  pour Bottom (isolate 0.508): 126.37,59.67 126.37,66.83 arc90 63.65,129.54 arc90 -1.91,63.98 arc90 62.08,0.32 67.33,0.34 arc90
MISO
  Top 0.254: IC2.16 66.3,56.14 63.81,53.65 SV1.2
MOSI
  Top 0.254: IC2.15 65.5,57.88 61.27,53.65 SV1.1
N$1
  Top 0.254: IC3.31 39.54,46.04 arc45 40,45.85 42.17,48.01 R2.2
N$7
  Top 0.254: IC2.7 57.28,61.5 X1.2 C3.1
N$8
  Top 0.254: IC2.8 58.5,60.7 X1.1 C4.1
N$13
  Top 0.254: IC1.31 65.75,98.78 arc45 65.08,99.06 arc45 64.55,98.84 arc45 64.14,97.84 64.14,94.76 arc45 64.33,94.3 67,91.63 R1.2
N$64
  Top 0.254: IC4.31 73.79,33.08 arc-90 R3.2
RST  (via drill 0.51)
  Top 0.254: 63.16,67.85 IC2.29 63.1,69.2 | 63.1,69.2 v62.23,69.22 | S1.3 arc-90 63.1,71.81 63.1,69.2
  Bottom 0.254: v62.23,69.22 62.23,63.5 71.75,53.98 71.75,51.61 SV1.5
SCK
  Top 0.254: SV1.3 66.35,53.65 67.79,55.09 IC2.17
SCLK  (via drill 0.51)
  Top 0.254: IC3.3 33.02,54.61 32.89,55.75 32.89,56.64 arc90 v32.39,57.15 | IC1.3 73.28,92.17 73.28,74.93 | 73.28,74.93 73.28,71.79 IC2.24 67.94,66.45 | IC4.3 86.63,33.73 arc-45 87.13,33.52 87.44,33.21 arc-45 87.63,32.76 87.63,30.99 arc-90 82.67,26.03 67.79,26.03 arc-45 53.96,31.76 v43.18,42.55 | v71.12,74.93 73.28,74.93
  Bottom 0.254: v43.18,42.55 32.39,53.34 v32.39,57.15 32.39,59.05 arc-90 48.26,74.93 v71.12,74.93
SIN
  Top 0.254: IC1.4 73.91,92.45 73.91,70.61 68.8,65.5 IC2.23
SOUT
  Top 0.254: IC1.29 65.58,100.73 arc26 62.32,101.2 36.22,98.67 arc70 23.43,87.91 arc28 23.39,83.53 27.68,65.92 arc13 30.3,58.84 IC3.4
SOUT_2
  Top 0.254: IC4.4 87.34,34.38 arc-90 88.39,33.33 88.39,28.58 arc-45 87.58,26.62 arc-45 83.45,24.91 66.51,24.91 arc-44 54.11,29.94 37.85,45.72 arc-20 IC3.29
VCC  (via drill 0.51, 1.02)
  Top 0.254: 124.6,60.29 LED1.A LED2.A LED3.A LED4.A LED5.A LED6.A LED7.A LED8.A LED9.A LED10.A LED11.A LED12.A LED13.A LED14.A LED15.A LED16.A LED17.A LED18.A LED19.A LED20.A LED21.A LED22.A LED23.A LED24.A LED25.A LED26.A LED27.A LED28.A LED29.A LED30.A LED31.A LED32.A LED33.A LED34.A LED35.A LED36.A LED37.A LED38.A LED39.A LED40.A LED41.A LED42.A LED43.A LED44.A LED45.A LED46.A LED47.A LED48.A LED49.A LED50.A LED51.A LED52.A LED53.A | 124.6,60.29 LED60.A LED59.A LED58.A LED57.A LED56.A LED55.A LED54.A | IC1.32 65.52,97.78 arc45 65.15,96.89 65.15,95.52 arc45 65.52,94.63 68.33,91.82 v68.33,70.36 | IC2.4 58.27,63.9 57.66,64.52 | 57.66,64.52 57.53,64.64 57.53,68.22 C1.1 arc90 40.64,52.36 40.64,49.14 IC3.32 | 59.26,62.36 60.33,62.36 61.18,61.5 66.04,61.5 | 59.26,62.36 IC2.6 | 70.81,60.33 70.81,62.7 C2.1 69.85,63 | 69.85,63 67.9,63 | 67.9,63 IC2.20 | IC2.18 66.04,61.5 | 67.9,63 66.17,63 66.04,62.87 66.04,61.5 | 124.6,60.29 103.32,60.29 arc90 103.29,60.33 70.81,60.33 | IC4.32 77.39,31.98 arc-45 75.31,31.12 v73.66,31.12 | v69.85,61.59 69.85,63 | SV1.4 69.22,51.61 69.22,56.52 70.81,58.11 70.81,60.33 | 59.26,62.36 58.04,62.36 57.53,62.87 57.53,64.39 57.66,64.52
  Bottom 0.254: v68.33,70.36 69.85,68.45 v69.85,61.59 | SV1.4 68.89,35.89 arc90 v73.66,31.12
XLAT  (via drill 0.51)
  Top 0.254: IC1.30 66.04,99.41 arc45 65.66,99.57 65.11,99.57 arc90 62.99,97.45 62.99,94.48 arc42 63.33,93.61 65.5,91.22 65.5,70.48 | 65.5,70.48 IC2.26 | 45.09,45.09 40.59,45.09 arc-45 38.9,45.79 IC3.30 | IC4.30 76.61,33.73 arc-45 75.58,34.15 75.04,34.69 arc45 74.47,34.92 61.41,34.92 arc-45 50.89,39.28 45.09,45.09 | 45.09,45.09 49,49 arc45 52.7,57.95 v52.7,66.04 | v65.79,70.48 65.5,70.48
  Bottom 0.254: v52.7,66.04 57.15,70.48 v65.79,70.48

### Text on the board
tNames: charliex